# Altium schematic sheet VU_LED.SchDoc
size A4; Organization: Altium Limited; Address1: L3, 12a Rodborough Rd; Address2: Frenchs Forest; Address3: NSW; Address4: Australia 2086
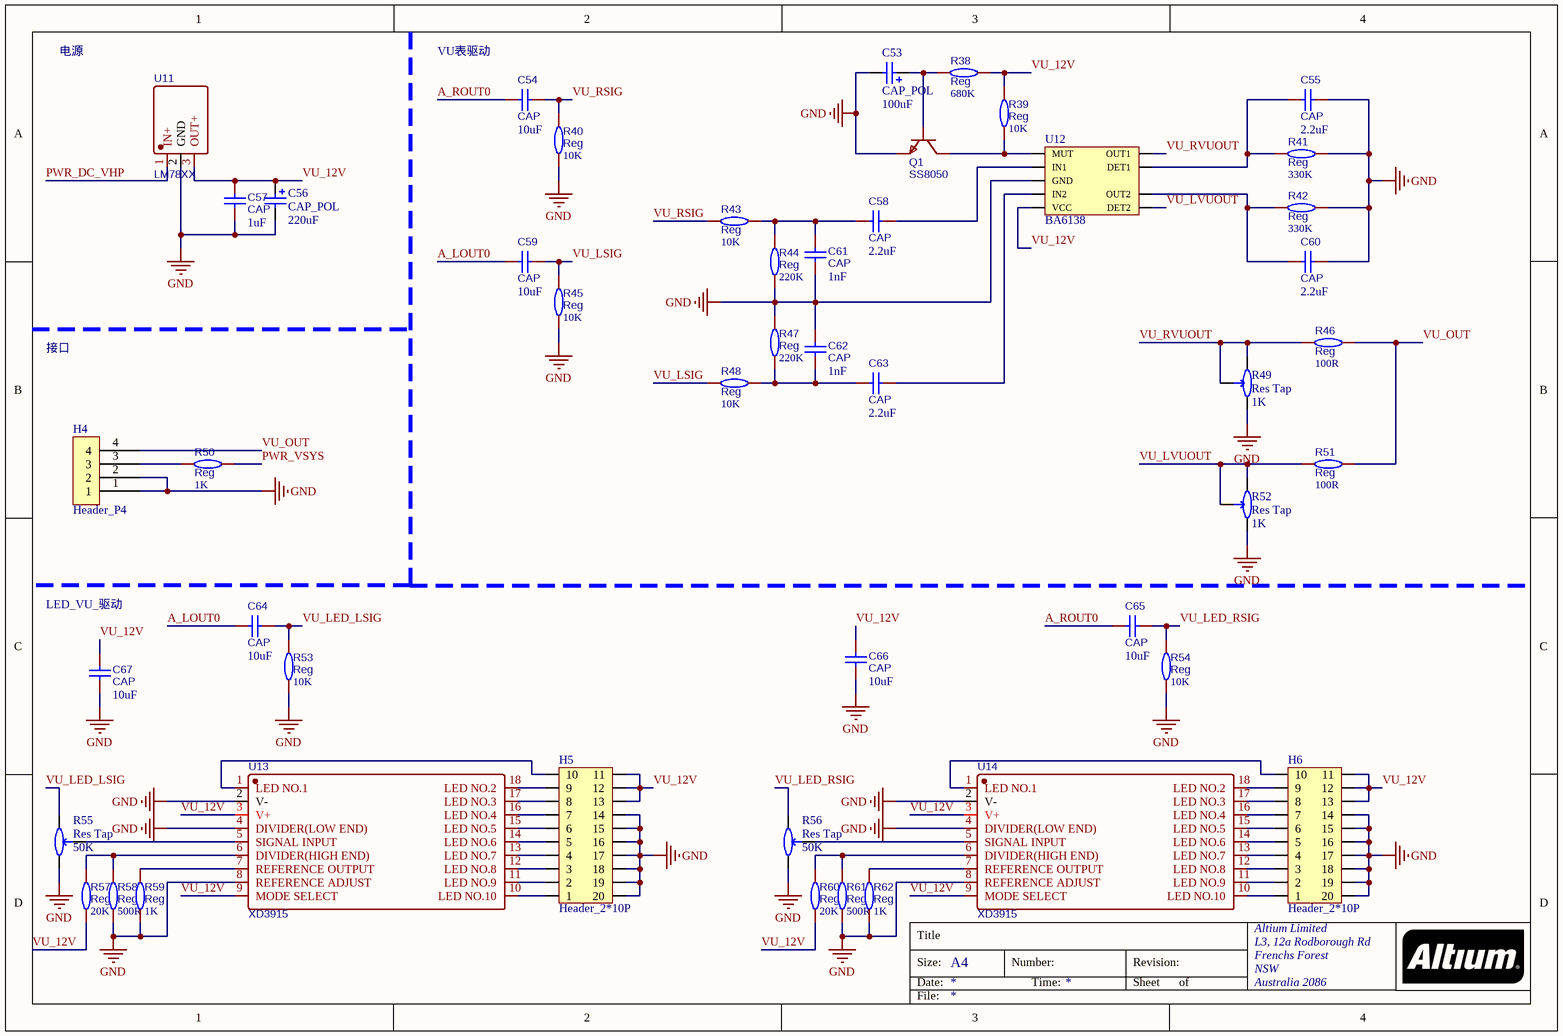
[diagram p0: VU_LED.SchDoc]

## Parts
C53  CAP_POL  value 100uF  [CAP_SMD_6.3mm]
C54  CAP  value 10uF  [C0603]
C55  CAP  value 2.2uF  [C0603]
C56  CAP_POL  value 220uF  [CAP_SMD_6.3mm]
C57  CAP  value 1uF  [C0603]
C58  CAP  value 2.2uF  [C0603]
C59  CAP  value 10uF  [C0603]
C60  CAP  value 2.2uF  [C0603]
C61  CAP  value 1nF  [C0603]
C62  CAP  value 1nF  [C0603]
C63  CAP  value 2.2uF  [C0603]
C64  CAP  value 10uF  [C0603]
C65  CAP  value 10uF  [C0603]
C66  CAP  value 10uF  [C0603]
C67  CAP  value 10uF  [C0603]
H4  Header_P4  [PH_4Pin]
H5  Header_2*10P  [H_2.0_10x2Pin]
H6  Header_2*10P  [H_2.0_10x2Pin]
Q1  SS8050  [SOT-23-3]
R38  Reg  value 680K  [R0603]
R39  Reg  value 10K  [R0603]
R40  Reg  value 10K  [R0603]
R41  Reg  value 330K  [R0603]
R42  Reg  value 330K  [R0603]
R43  Reg  value 10K  [R0603]
R44  Reg  value 220K  [R0603]
R45  Reg  value 10K  [R0603]
R46  Reg  value 100R  [R0603]
R47  Reg  value 220K  [R0603]
R48  Reg  value 10K  [R0603]
R49  Res Tap  value 1K  [RES_TAP_HOR]
R50  Reg  value 1K  [R0603]
R51  Reg  value 100R  [R0603]
R52  Res Tap  value 1K  [RES_TAP_HOR]
R53  Reg  value 10K  [R0603]
R54  Reg  value 10K  [R0603]
R55  Res Tap  value 50K  [RES_TAP_HOR]
R56  Res Tap  value 50K  [RES_TAP_HOR]
R57  Reg  value 20K  [R0603]
R58  Reg  value 500R  [R0603]
R59  Reg  value 1K  [R0603]
R60  Reg  value 20K  [R0603]
R61  Reg  value 500R  [R0603]
R62  Reg  value 1K  [R0603]
U11  LM78XX  [TO-220-3_2.54_HOR]
U12  BA6138  [SIP9-2.54]
U13  XD3915  [DIP-18]
U14  XD3915  [DIP-18]

## Nets
GND: C53.2 C55.1 C56.2 C57.2 C60.1 C61.1 C62.2 C66.2 C67.2 H4.1 H4.2 H5.14 H5.15 H5.16 H5.17 H5.18 H5.19 H5.20 H6.14 H6.15 H6.16 H6.17 H6.18 H6.19 H6.20 Q1.2(E) R40.1 R41.1 R42.1 R44.2 R45.1 R47.1 R49.1(A) R52.1(A) R53.1 R54.1 R55.2(B) R56.2(B) R58.2 R59.2 R61.2 R62.2 U11.2(GND) U12.5(GND) U13.2(V-) U13.4(DIVIDER(LOW_END)) U13.8(REFERENCE_ADJUST) U14.2(V-) U14.4(DIVIDER(LOW_END)) U14.8(REFERENCE_ADJUST)
A_LOUT0: C59.1 C64.1
A_ROUT0: C54.1 C65.1
PWR_DC_VHP: U11.1(IN+)
PWR_VSYS: R50.1
VU_12V: C56.1 C57.1 C66.1 C67.1 H5.11 H5.12 H5.13 H6.11 H6.12 H6.13 R38.1 R39.2 R57.2 R60.2 U11.3(OUT+) U12.9(VCC) U13.3(V+) U13.9(MODE_SELECT) U14.3(V+) U14.9(MODE_SELECT)
VU_LED_LSIG: C64.2 R53.2 R55.1(A)
VU_LED_RSIG: C65.2 R54.2 R56.1(A)
VU_LSIG: C59.2 R45.2 R48.2
VU_LVUOUT: R51.2 R52.2(B) R52.3(TAP) U12.7(DET2)
VU_OUT: H4.4 R46.1 R51.1
VU_RSIG: C54.2 R40.2 R43.2
VU_RVUOUT: R46.2 R49.2(B) R49.3(TAP) U12.2(OUT1)
NetC53_1: C53.1 Q1.1(B) R38.2
NetC55_2: C55.2 R41.2 U12.3(DET1)
NetC58_1: C58.1 C61.2 R43.1 R44.1
NetC58_2: C58.2 U12.4(IN1)
NetC60_2: C60.2 R42.2 U12.8(OUT2)
NetC62_1: C62.1 C63.1 R47.2 R48.1
NetC63_2: C63.2 U12.6(IN2)
NetH4_3: H4.3 R50.2
NetH5_1: H5.1 U13.10(LED_NO.10)
NetH5_2: H5.2 U13.11(LED_NO.9)
NetH5_3: H5.3 U13.12(LED_NO.8)
NetH5_4: H5.4 U13.13(LED_NO.7)
NetH5_5: H5.5 U13.14(LED_NO.6)
NetH5_6: H5.6 U13.15(LED_NO.5)
NetH5_7: H5.7 U13.16(LED_NO.4)
NetH5_8: H5.8 U13.17(LED_NO.3)
NetH5_9: H5.9 U13.18(LED_NO.2)
NetH5_10: H5.10 U13.1(LED_NO.1)
NetH6_1: H6.1 U14.10(LED_NO.10)
NetH6_2: H6.2 U14.11(LED_NO.9)
NetH6_3: H6.3 U14.12(LED_NO.8)
NetH6_4: H6.4 U14.13(LED_NO.7)
NetH6_5: H6.5 U14.14(LED_NO.6)
NetH6_6: H6.6 U14.15(LED_NO.5)
NetH6_7: H6.7 U14.16(LED_NO.4)
NetH6_8: H6.8 U14.17(LED_NO.3)
NetH6_9: H6.9 U14.18(LED_NO.2)
NetH6_10: H6.10 U14.1(LED_NO.1)
NetQ1_3: Q1.3(C) R39.1 U12.1(MUT)
NetR55_3: R55.3(TAP) U13.5(SIGNAL_INPUT)
NetR56_3: R56.3(TAP) U14.5(SIGNAL_INPUT)
NetR57_1: R57.1 R58.1 U13.6(DIVIDER(HIGH_END))
NetR59_1: R59.1 U13.7(REFERENCE_OUTPUT)
NetR60_1: R60.1 R61.1 U14.6(DIVIDER(HIGH_END))
NetR62_1: R62.1 U14.7(REFERENCE_OUTPUT)

## Notes on the sheet
- 电源
- VU表驱动
- 接口
- LED_VU_驱动
- Title
- Size:
- Date:
- A4
- Number:
- Time:
- Revision:
- Sheet
- of
- File:

## Library data of the parts
C53 C56 = CAP_POL: 极性电容
C54 C55 C57-C67 = CAP: BOM_Manufacturer: Huaxin S&T; BOM_Manufacturer Part: 0603B103K101CT; nameAlias: Capacitance; Contributor: LCSC; BOM_Supplier: LCSC; BOM_Supplier Part: C302008; spicePre: C; spiceSymbolName: 0603B103K101CT
H4 = Header_P4: 4Pin排针
H5 H6 = Header_2*10P: 2*10P连接器
Q1 = SS8050: NPN; BOM_Manufacturer: AnBon; Contributor: LCSC; BOM_Paste Type: recommend; BOM_Supplier: LCSC; BOM_Supplier Part: C541705; BOM_Manufacturer Part: SS8050; spicePre: Q; spiceSymbolName: SS8050_C541705
R38-R48 R50 R51 R53 R54 R57-R62 = Res: 电阻; BOM_Manufacturer: Viking Tech; BOM_Manufacturer Part: AR03BTCX1002A; nameAlias: Resistance (Ohms); Contributor: LCSC; BOM_Supplier: LCSC; BOM_Supplier Part: C465721; spicePre: R; spiceSymbolName: AR03BTCX1002A
R49 R52 R55 R56 = Res Tap: 可调电阻; Sim Note: Enter the Resistance value and the set point into parameter fields.; Set Position: 0.5; Published: 24-Mar-1999; LatestRevisionDate: 17-Jul-2002; LatestRevisionNote: Re-released for DXP Platform.; PackageReference: VR3; Publisher: Altium Limited; PackageDescription: Variable Resistor, Thru-Hole; 3 Leads
U11 = LM78XX: 三端稳压(正电压); BOM_Manufacturer: HGSEMI(华冠); BOM_Manufacturer Part: LM7812T; Contributor: LCSC; BOM_Supplier: LCSC; BOM_Supplier Part: C2902509; BOM_JLCPCB Part Class: Extended Part; spicePre: U; spiceSymbolName: LM7812T
U12 = BA6138: 对数放大器
U13 U14 = LM3915: 电平指示; BOM_Manufacturer: XINLUDA(信路达); Contributor: LCSC; BOM_Supplier: LCSC; BOM_Supplier Part: C609778; BOM_Manufacturer Part: XD3915; BOM_JLCPCB Part Class: Extended Part; Frequency: -; spicePre: U; spiceSymbolName: XD3915